# EAGLE design TABBx Lure 1.0 (EAGLE 7.4.0)
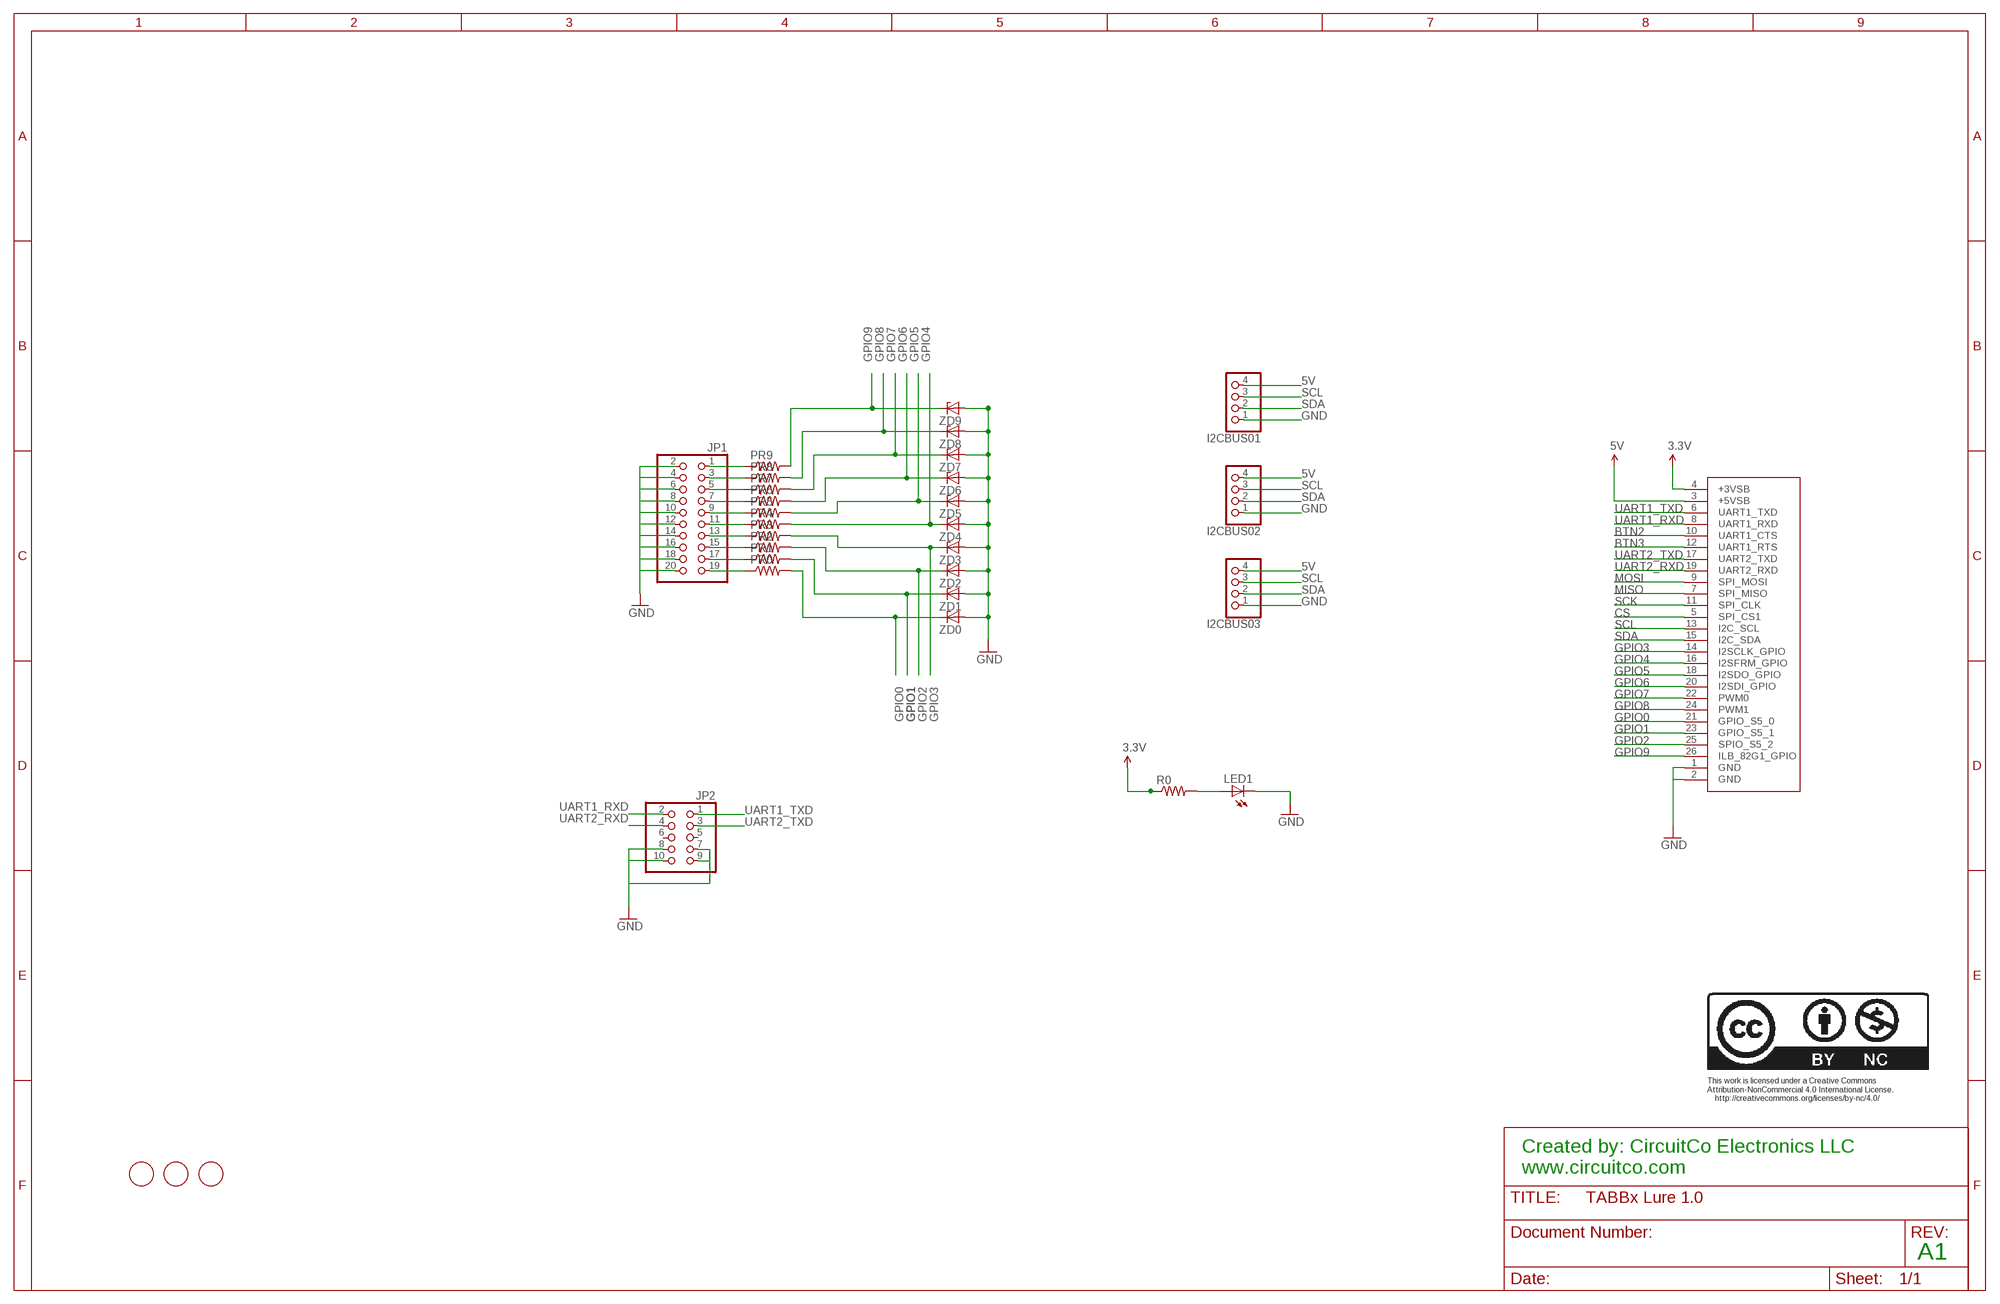
[diagram p0: schematic, sheet 1]

## Parts
I2CBUS01  PINHD-1X4  [1X04]
I2CBUS02  PINHD-1X4  [1X04]
I2CBUS03  PINHD-1X4  [1X04]
JP1  PINHD-2X10/90  [2X10/90]
JP2  PINHD-2X5/90  [2X05/90]
JP4  MINNOW2_LOW_SPEED  [MINNOWBOARD_2_LOW_SPEED]
LED1  LEDCHIPLED_1206  [CHIPLED_1206]
PR0  R-US_M1206  [M1206]
PR1  R-US_M1206  [M1206]
PR2  R-US_M1206  [M1206]
PR3  R-US_M1206  [M1206]
PR4  R-US_M1206  [M1206]
PR5  R-US_M1206  [M1206]
PR6  R-US_M1206  [M1206]
PR7  R-US_M1206  [M1206]
PR8  R-US_M1206  [M1206]
PR9  R-US_M1206  [M1206]
R0  R-US_M1206  [M1206]
U$3  FIDUCIAL  [FIDUCIAL_1MM]
U$5  FIDUCIAL  [FIDUCIAL_1MM]
U$6  FIDUCIAL  [FIDUCIAL_1MM]
ZD0  ZENER-DIODEDO35Z10  [DO35Z10]
ZD1  ZENER-DIODEDO35Z10  [DO35Z10]
ZD2  ZENER-DIODEDO35Z10  [DO35Z10]
ZD3  ZENER-DIODEDO35Z10  [DO35Z10]
ZD4  ZENER-DIODEDO35Z10  [DO35Z10]
ZD5  ZENER-DIODEDO35Z10  [DO35Z10]
ZD6  ZENER-DIODEDO35Z10  [DO35Z10]
ZD7  ZENER-DIODEDO35Z10  [DO35Z10]
ZD8  ZENER-DIODEDO35Z10  [DO35Z10]
ZD9  ZENER-DIODEDO35Z10  [DO35Z10]

## Nets
3.3V: JP4.4(+3VSB) R0.1
5V: I2CBUS01.4 I2CBUS02.4 I2CBUS03.4 JP4.3(+5VSB)
BTN2: JP4.10(UART1_CTS)
BTN3: JP4.12(UART1_RTS)
CS: JP4.5(SPI_CS1)
GND: I2CBUS01.1 I2CBUS02.1 I2CBUS03.1 JP1.2 JP1.4 JP1.6 JP1.8 JP1.10 JP1.12 JP1.14 JP1.16 JP1.18 JP1.20 JP2.7 JP2.8 JP2.9 JP2.10 JP4.1(GND) JP4.2(GND) LED1.C ZD0.A ZD1.A ZD2.A ZD3.A ZD4.A ZD5.A ZD6.A ZD7.A ZD8.A ZD9.A
GPIO0: JP4.21(GPIO_S5_0) PR0.2 ZD0.C
GPIO1: JP4.23(GPIO_S5_1) PR1.2 ZD1.C
GPIO2: JP4.25(SPIO_S5_2) PR2.2 ZD2.C
GPIO3: JP4.14(I2SCLK_GPIO) PR3.2 ZD3.C
GPIO4: JP4.16(I2SFRM_GPIO) PR4.2 ZD4.C
GPIO5: JP4.18(I2SDO_GPIO) PR5.2 ZD5.C
GPIO6: JP4.20(I2SDI_GPIO) PR6.2 ZD6.C
GPIO7: JP4.22(PWM0) PR7.2 ZD7.C
GPIO8: JP4.24(PWM1) PR8.2 ZD8.C
GPIO9: JP4.26(ILB_82G1_GPIO) PR9.2 ZD9.C
MISO: JP4.7(SPI_MISO)
MOSI: JP4.9(SPI_MOSI)
N$1: JP1.1 PR9.1
N$2: JP1.3 PR8.1
N$3: JP1.5 PR7.1
N$4: JP1.7 PR6.1
N$5: JP1.9 PR5.1
N$6: JP1.11 PR4.1
N$7: JP1.13 PR3.1
N$8: JP1.15 PR2.1
N$9: JP1.17 PR1.1
N$10: JP1.19 PR0.1
N$11: LED1.A R0.2
SCK: JP4.11(SPI_CLK)
SCL: I2CBUS01.3 I2CBUS02.3 I2CBUS03.3 JP4.13(I2C_SCL)
SDA: I2CBUS01.2 I2CBUS02.2 I2CBUS03.2 JP4.15(I2C_SDA)
UART1_RXD: JP2.2 JP4.8(UART1_RXD)
UART1_TXD: JP2.1 JP4.6(UART1_TXD)
UART2_RXD: JP2.4 JP4.19(UART2_RXD)
UART2_TXD: JP2.3 JP4.17(UART2_TXD)
Unconnected: JP2.5 JP2.6

## Notes on the sheet
- Created by: CircuitCo Electronics LLC
  www.circuitco.com
- A1

## Library data of the parts
I2CBUS01-I2CBUS03 = pinhead:PINHD-1X4: PIN HEADER
JP1 = pinhead:PINHD-2X10: PIN HEADER
JP2 = pinhead:PINHD-2X5: PIN HEADER
JP4 = CircuitCo:MINNOW2_LOW_SPEED
LED1 = led:LED: LED OSRAM: - CHIPLED LG R971, LG N971, LY N971, LG Q971, LY Q971, LO R971, LY R971 LH N974, LH R974 LS Q976, LO Q976, LY Q976 LO Q996 - Hyper CHIPLED LW Q18S LB Q993, LB Q99A, LB R99A - SideLED LS A670, LO A670, LY A670, LG A670, LP A670 LB A673, LV A673, LT A673, LW A673 LH A674 LY A675 LS A676, LA A676, LO A676, LY A676, LW A676 LS A679, LY A679, LG A679 - Hyper Micro SIDELED® LS Y876, LA Y876, LO Y876, LY Y876 LT Y87S - SmartLED LW L88C, LW L88S LB L89C, LB L89S, LG L890 LS L89K, LO L89K, LY L89K LS L896, LA L896, LO L896, LY L896 - TOPLED LS T670, LO T670, LY T670, LG T670, LP T670 LSG T670, LSP T670, LSY T670, LOP T670, LYG T670 LG T671, LOG T671, LSG T671 LB T673, LV T673, LT T673, LW T673 LH T674 LS T676, LA T676, LO T676, LY T676, LB T676, LH T676, LSB T676, LW T676 LB T67C, LV T67C, LT T67C, LS T67K, LO T67K, LY T67K, LW E67C LS E67B, LA E67B, LO E67B, LY E67B, LB E67C, LV E67C, LT E67C LW T67C LS T679, LY T679, LG T679 LS T770, LO T770, LY T770, LG T770, LP T770 LB T773, LV T773, LT T773, LW T773 LH T774 LS E675, LA E675, LY E675, LS T675 LS T776, LA T776, LO T776, LY T776, LB T776 LHGB T686 LT T68C, LB T68C - Hyper Mini TOPLED® LB M676 - Mini TOPLED Santana® LG M470 LS M47K, LO M47K, LY M47K Source: http://www.osram.convergy.de LUXEON: - LUMILED® LXK2-PW12-R00, LXK2-PW12-S00, LXK2-PW14-U00, LXK2-PW14-V00 LXK2-PM12-R00, LXK2-PM12-S00, LXK2-PM14-U00 LXK2-PE12-Q00, LXK2-PE12-R00, LXK2-PE12-S00, LXK2-PE14-T00, LXK2-PE14-U00 LXK2-PB12-K00, LXK2-PB12-L00, LXK2-PB12-M00, LXK2-PB14-N00, LXK2-PB14-P00, LXK2-PB14-Q00 LXK2-PR12-L00, LXK2-PR12-M00, LXK2-PR14-Q00, LXK2-PR14-R00 LXK2-PD12-Q00, LXK2-PD12-R00, LXK2-PD12-S00 LXK2-PH12-R00, LXK2-PH12-S00 LXK2-PL12-P00, LXK2-PL12-Q00, LXK2-PL12-R00 Source: www.luxeon.com KINGBRIGHT: KA-3528ASYC Source: www.kingbright.com
PR0 PR1-PR9 R0 = adafruit:R-US_: RESISTOR, American symbol
U$3 U$5 U$6 = adafruit:FIDUCIAL: For use by pick and place machines to calibrate the vision/machine, 1mm By microbuilder.eu
ZD0 ZD1-ZD9 = diode:ZENER-DIODE: Z-Diode

## Board
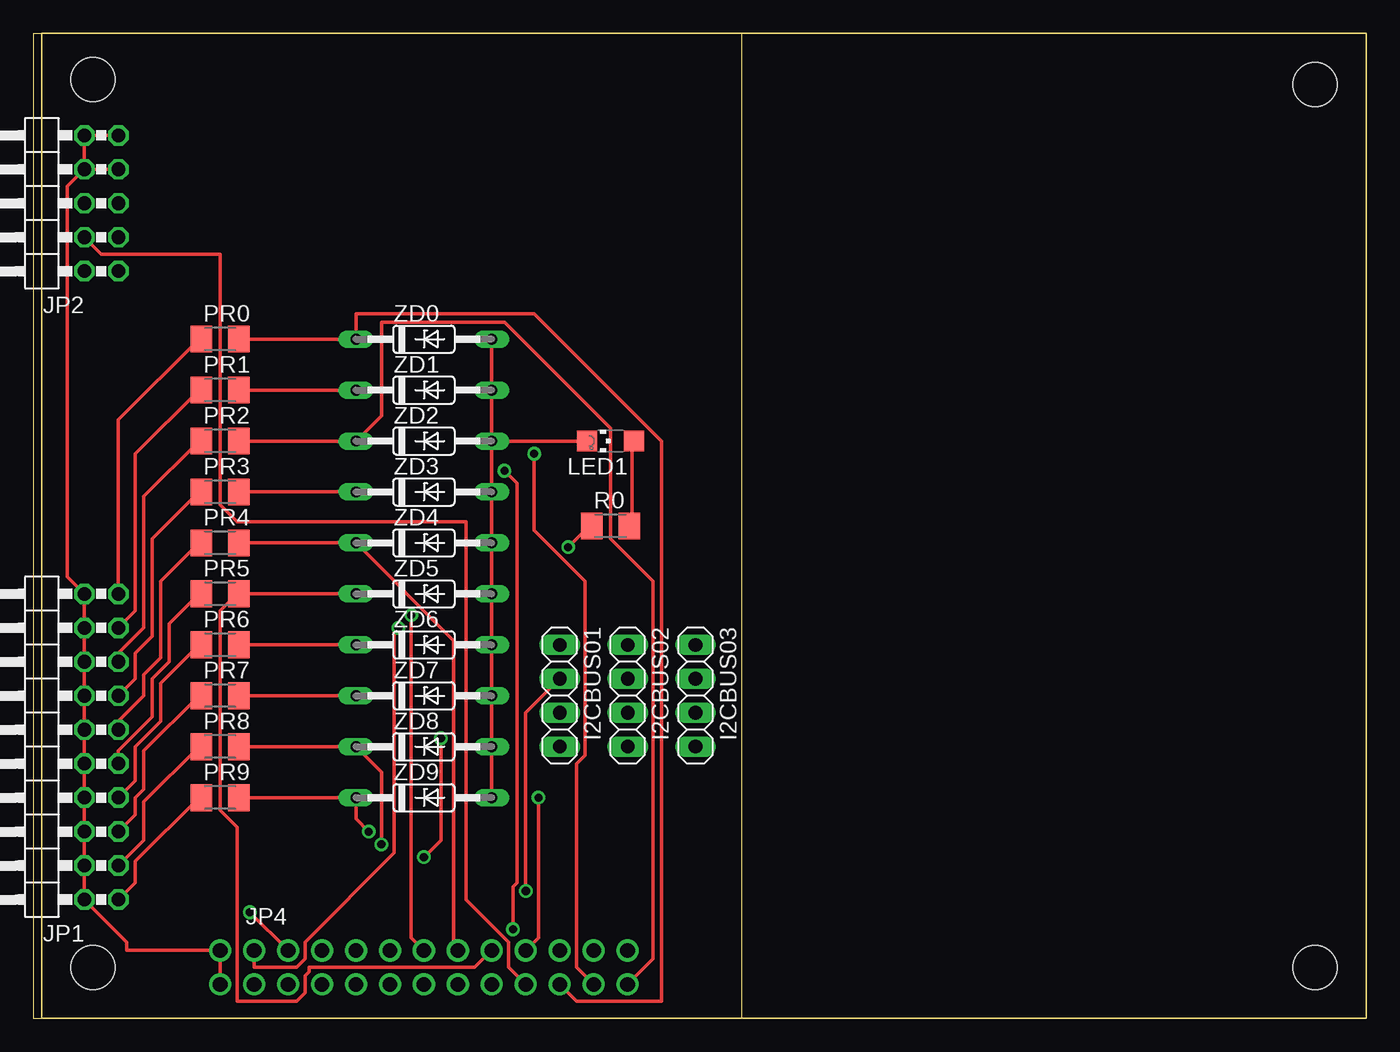
[diagram p1: board, top side]
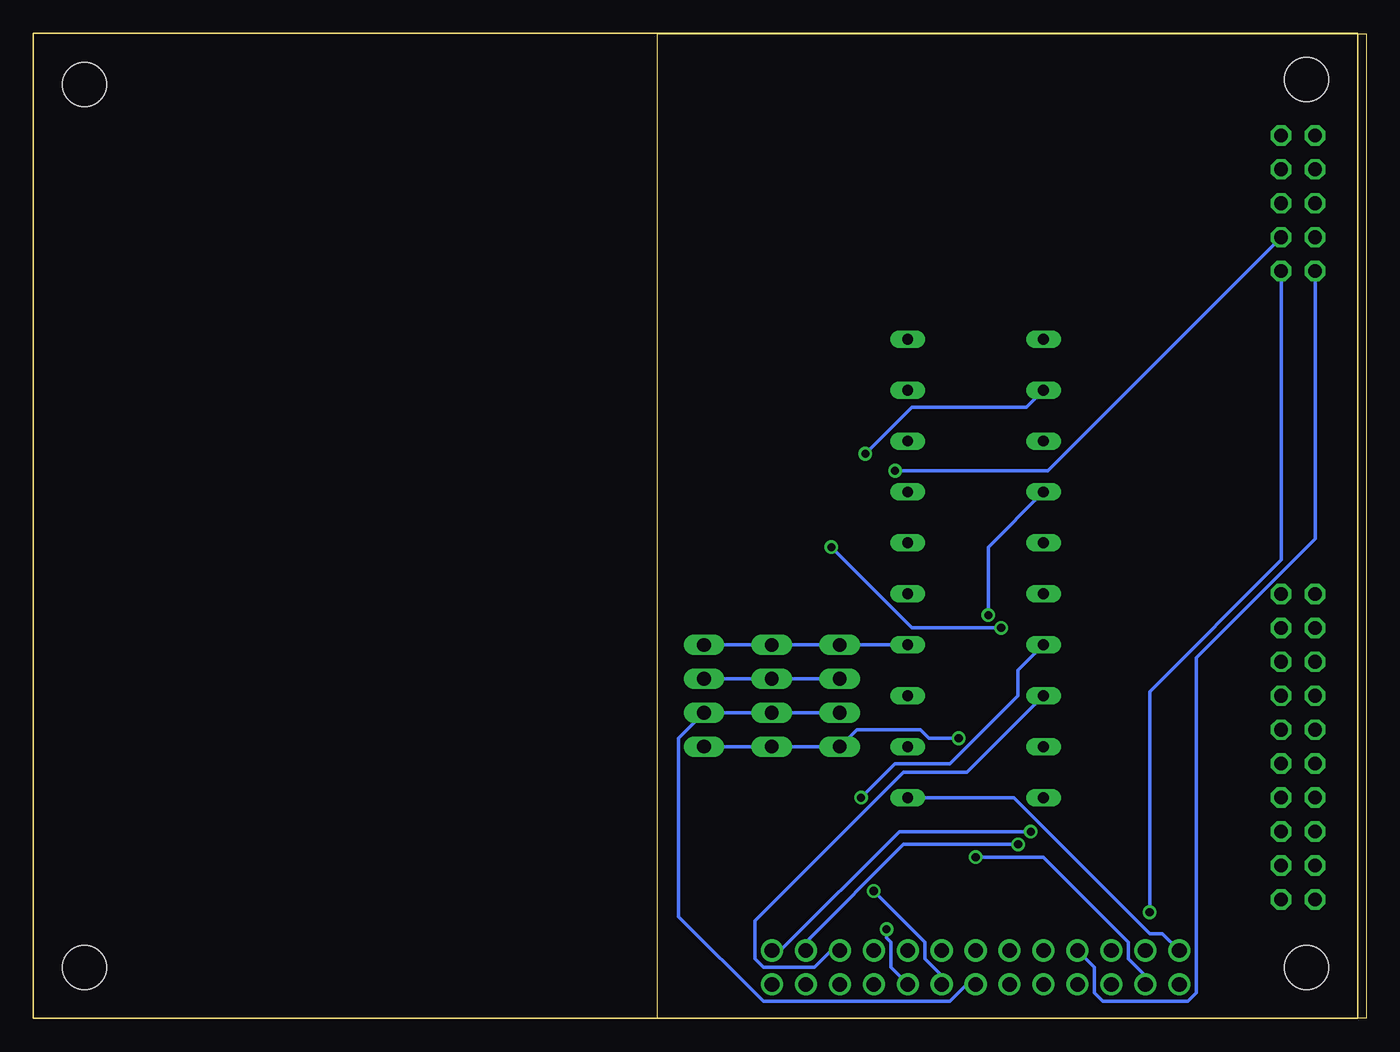
[diagram p2: board, bottom side, seen from below]

Size 53.01 x 73.65 mm. Coordinates in mm from the lower left corner, seen from the top.
Outline: 0,0 53.01,0 53.01,73.65 0,73.65 0,0
Copper layers (1*16): Top 0.035mm / dielectric 1.5mm / Bottom 0.035mm
Design rules "default": minimum track width 10mil, minimum drill 24mil, track to track 8mil, track to pad 8mil, pad to pad 8mil, via to via 8mil, smd to smd 8mil, copper to edge 40mil, drill to drill 8mil, minimum pad ring 10mil, minimum via ring 8mil, stop-mask expansion 4mil, vias tented up to drill 0mil, thermal gap 10mil

### Footprints (pad centres in the part's own frame; a part is rotated, then mirrored left to right if it is on the bottom)
1X04 = drill 1.016 long: 1 -3.81,0; 2 -1.27,0; 3 1.27,0; 4 3.81,0
2X10/90 = drill 1.016 octagon: 1 -11.43,-6.35; 2 -11.43,-3.81; 3 -8.89,-6.35; 4 -8.89,-3.81; 5 -6.35,-6.35; 6 -6.35,-3.81; 7 -3.81,-6.35; 8 -3.81,-3.81; 9 -1.27,-6.35; 10 -1.27,-3.81; 11 1.27,-6.35; 12 1.27,-3.81; 13 3.81,-6.35; 14 3.81,-3.81; 15 6.35,-6.35; 16 6.35,-3.81; 17 8.89,-6.35; 18 8.89,-3.81; 19 11.43,-6.35; 20 11.43,-3.81
2X05/90 = drill 1.016 octagon: 1 -5.08,-6.35; 2 -5.08,-3.81; 3 -2.54,-6.35; 4 -2.54,-3.81; 5 0,-6.35; 6 0,-3.81; 7 2.54,-6.35; 8 2.54,-3.81; 9 5.08,-6.35; 10 5.08,-3.81
MINNOWBOARD_2_LOW_SPEED = drill 1.1: 1 -15.24,0; 2 -15.24,2.54; 3 -12.7,0; 4 -12.7,2.54; 5 -10.16,0; 6 -10.16,2.54; 7 -7.62,0; 8 -7.62,2.54; 9 -5.08,0; 10 -5.08,2.54; 11 -2.54,0; 12 -2.54,2.54; 13 0,0; 14 0,2.54; 15 2.54,0; 16 2.54,2.54; 17 5.08,0; 18 5.08,2.54; 19 7.62,0; 20 7.62,2.54; 21 10.16,0; 22 10.16,2.54; 23 12.7,0; 24 12.7,2.54; 25 15.24,0; 26 15.24,2.54 | hole 3.302: -24.765,1.27; -24.765,67.691; 66.675,1.27; 66.675,67.31
CHIPLED_1206 = smd 1.5 x 1.5: A 0,-1.75; C 0,1.75
M1206 = smd 1.6 x 2: 1 -1.4,0; 2 1.4,0
FIDUCIAL_1MM = smd 1 x 1: 1 0,0
DO35Z10 = drill 0.813 long: A 5.08,0; C -5.08,0

### Placement (x,y rotation side)
I2CBUS01  39.37,24.13 270 top
I2CBUS02  44.45,24.13 270 top
I2CBUS03  49.53,24.13 270 top
JP1  0,20.32 90 top
JP2  0,60.96 90 top
JP4  29.21,2.54 0 top
LED1  43.18,43.18 90 top
PR0  13.97,50.8 0 top
PR1  13.97,46.99 0 top
PR2  13.97,43.18 0 top
PR3  13.97,39.37 0 top
PR4  13.97,35.56 0 top
PR5  13.97,31.75 0 top
PR6  13.97,27.94 0 top
PR7  13.97,24.13 0 top
PR8  13.97,20.32 0 top
PR9  13.97,16.51 0 top
R0  43.18,36.83 0 top
U$3  95.25,69.85 0 top  (outside the outline)
U$5  3.81,69.85 0 top
U$6  96.52,3.81 0 top  (outside the outline)
ZD0  29.21,50.8 0 top
ZD1  29.21,46.99 0 top
ZD2  29.21,43.18 0 top
ZD3  29.21,39.37 0 top
ZD4  29.21,35.56 0 top
ZD5  29.21,31.75 0 top
ZD6  29.21,27.94 0 top
ZD7  29.21,24.13 0 top
ZD8  29.21,20.32 0 top
ZD9  29.21,16.51 0 top

### Tracks (layer width: path | path; a pad name or v marks a point on that pad's centre or on a via)
3.3V  (via drill 0.61)
  Top 0.254: v40.01,35.24 41.59,36.83 R0.1 | v27.3,29.21 26.99,28.89 26.99,12.38 20.32,5.71 20.32,4.45 19.68,3.81 16.51,3.81 JP4.4
  Bottom 0.254: v40.01,35.24 33.97,29.21 v27.3,29.21
5V  (via drill 0.61)
  Top 0.254: v29.21,12.06 30.48,13.33 v30.48,20.95
  Bottom 0.254: I2CBUS03.4 I2CBUS02.4 I2CBUS01.4 38.1,21.59 33.34,21.59 32.7,20.95 v30.48,20.95 | JP4.3 16.51,3.18 17.78,4.45 17.78,5.71 24.13,12.06 v29.21,12.06
GND
  Top 0.254: ZD0.A ZD1.A ZD2.A | ZD2.A LED1.C | ZD2.A ZD3.A ZD4.A ZD5.A ZD6.A ZD7.A ZD8.A ZD9.A | JP2.8 JP2.10 JP2.9 | JP2.8 JP2.7 | JP4.1 JP4.2 6.99,5.08 6.99,5.71 JP1.2 JP1.4 JP1.6 JP1.8 JP1.10 JP1.12 JP1.14 JP1.16 JP1.18 JP1.20 2.54,33.02 2.54,62.23 JP2.8
  Bottom 0.254: ZD6.A I2CBUS01.1 I2CBUS02.1 I2CBUS03.1 | ZD9.A 26.35,16.51 16.19,6.35 15.24,6.35 JP4.2
GPIO0
  Top 0.254: PR0.2 ZD0.C 24.13,52.7 37.47,52.7 46.99,43.18 46.99,1.27 40.64,1.27 JP4.21
GPIO1  (via drill 0.61)
  Top 0.254: ZD1.C PR1.2 | JP4.23 40.64,3.81 40.64,19.05 41.27,19.69 41.27,32.7 37.47,36.51 v37.47,42.23
  Bottom 0.254: v37.47,42.23 33.97,45.72 25.4,45.72 ZD1.C
GPIO2
  Top 0.254: PR2.2 ZD2.C 26.04,45.09 26.04,52.07 35.24,52.07 43.18,44.13 43.18,35.88 46.35,32.7 46.35,4.45 JP4.25
GPIO3  (via drill 0.61)
  Top 0.254: ZD3.C PR3.2 | JP4.14 28.26,6.03 v28.26,30.16
  Bottom 0.254: v28.26,30.16 28.26,35.24 ZD3.C
GPIO4
  Top 0.254: PR4.2 ZD4.C 31.43,28.26 31.43,5.4 JP4.16
GPIO5
  Top 0.254: ZD5.C PR5.2 15.24,31.75 13.97,30.48 13.97,15.56 15.24,14.29 15.24,1.27 19.68,1.27 20.32,1.91 20.32,3.18 20.64,3.49 20.64,3.81 33.02,3.81 JP4.18
GPIO6  (via drill 0.61)
  Top 0.254: ZD6.C PR6.2 | JP4.20 37.78,6.03 v37.78,16.51
  Bottom 0.254: v37.78,16.51 35.24,19.05 31.11,19.05 26.04,24.13 26.04,26.03 ZD6.C
GPIO7
  Top 0.254: ZD7.C PR7.2
  Bottom 0.254: JP4.22 40.01,5.08 41.27,3.81 45.09,3.81 45.72,4.45 45.72,7.3 34.61,18.41 29.84,18.41 ZD7.C
GPIO8  (via drill 0.61)
  Top 0.254: PR8.2 ZD8.C 26.04,18.41 v26.04,13.02
  Bottom 0.254: JP4.24 41.91,5.71 34.61,13.02 v26.04,13.02
GPIO9  (via drill 0.61)
  Top 0.254: PR9.2 ZD9.C 24.13,14.92 v25.08,13.97
  Bottom 0.254: JP4.26 43.81,5.08 34.92,13.97 v25.08,13.97
N$1
  Top 0.254: JP1.1 7.62,10.16 7.62,11.75 12.38,16.51 PR9.1
N$2
  Top 0.254: JP1.3 8.26,13.33 8.26,16.19 12.38,20.32 PR8.1
N$3
  Top 0.254: JP1.5 7.62,15.24 7.62,16.51 8.26,17.15 8.26,20 12.38,24.13 PR7.1
N$4
  Top 0.254: JP1.7 7.62,17.78 7.62,20.32 9.53,22.23 9.53,25.08 12.38,27.94 PR6.1
N$5
  Top 0.254: JP1.9 6.35,20 8.89,22.54 8.89,25.4 10.16,26.67 10.16,29.53 12.38,31.75 PR5.1
N$6
  Top 0.254: JP1.11 6.35,22.23 8.26,24.13 8.26,25.72 9.53,26.99 9.53,32.7 12.38,35.56 PR4.1
N$7
  Top 0.254: JP1.13 7.62,25.4 7.62,27.3 8.89,28.57 8.89,35.88 12.38,39.37 PR3.1
N$8
  Top 0.254: JP1.15 6.35,27.3 8.26,29.21 8.26,39.05 12.38,43.18 PR2.1
N$9
  Top 0.254: JP1.17 7.62,30.48 7.62,42.23 12.38,46.99 PR1.1
N$10
  Top 0.254: JP1.19 6.35,44.77 12.38,50.8 PR0.1
N$11
  Top 0.254: LED1.A 44.77,43.18 44.77,36.83 R0.2
SCL
  Bottom 0.254: I2CBUS01.3 I2CBUS02.3 I2CBUS03.3 51.44,20.95 51.44,7.62 45.09,1.27 31.11,1.27 29.84,2.54 JP4.13
SDA  (via drill 0.61)
  Top 0.254: v36.83,9.53 36.83,22.86 I2CBUS01.2
  Bottom 0.254: I2CBUS01.2 I2CBUS02.2 I2CBUS03.2 | JP4.15 31.75,3.18 33.02,4.45 33.02,5.71 v36.83,9.53
UART1_RXD
  Bottom 0.254: JP2.2 3.81,35.88 12.7,26.99 12.7,1.91 13.34,1.27 19.68,1.27 20.32,1.91 20.32,3.81 JP4.8
UART1_TXD  (via drill 0.61)
  Top 0.254: JP4.6 v16.19,7.94
  Bottom 0.254: JP2.1 6.35,34.29 16.19,24.45 v16.19,7.94
UART2_RXD
  Top 0.254: JP2.4 5.08,57.15 13.97,57.15 13.97,38.42 15.24,37.15 32.38,37.15 32.38,8.89 35.56,5.71 35.56,3.81 JP4.19
UART2_TXD  (via drill 0.61)
  Top 0.254: v35.24,40.96 36.2,40 36.2,10.16 35.88,9.84 v35.88,6.67
  Bottom 0.254: JP2.3 23.81,40.96 v35.24,40.96 | v35.88,6.67 35.88,6.03 35.56,5.71 35.56,3.81 JP4.17